# Altium project ECU_FEST24_Rev1.PrjPcb (part 2 of 2)

## Sheet PWR_CTRL.SchDoc: Power Control
size A4; Engineer: Rain Sarapuu; DocumentNumber: 6; Revision: 1; SheetNumber: 6; SheetTotal: 15
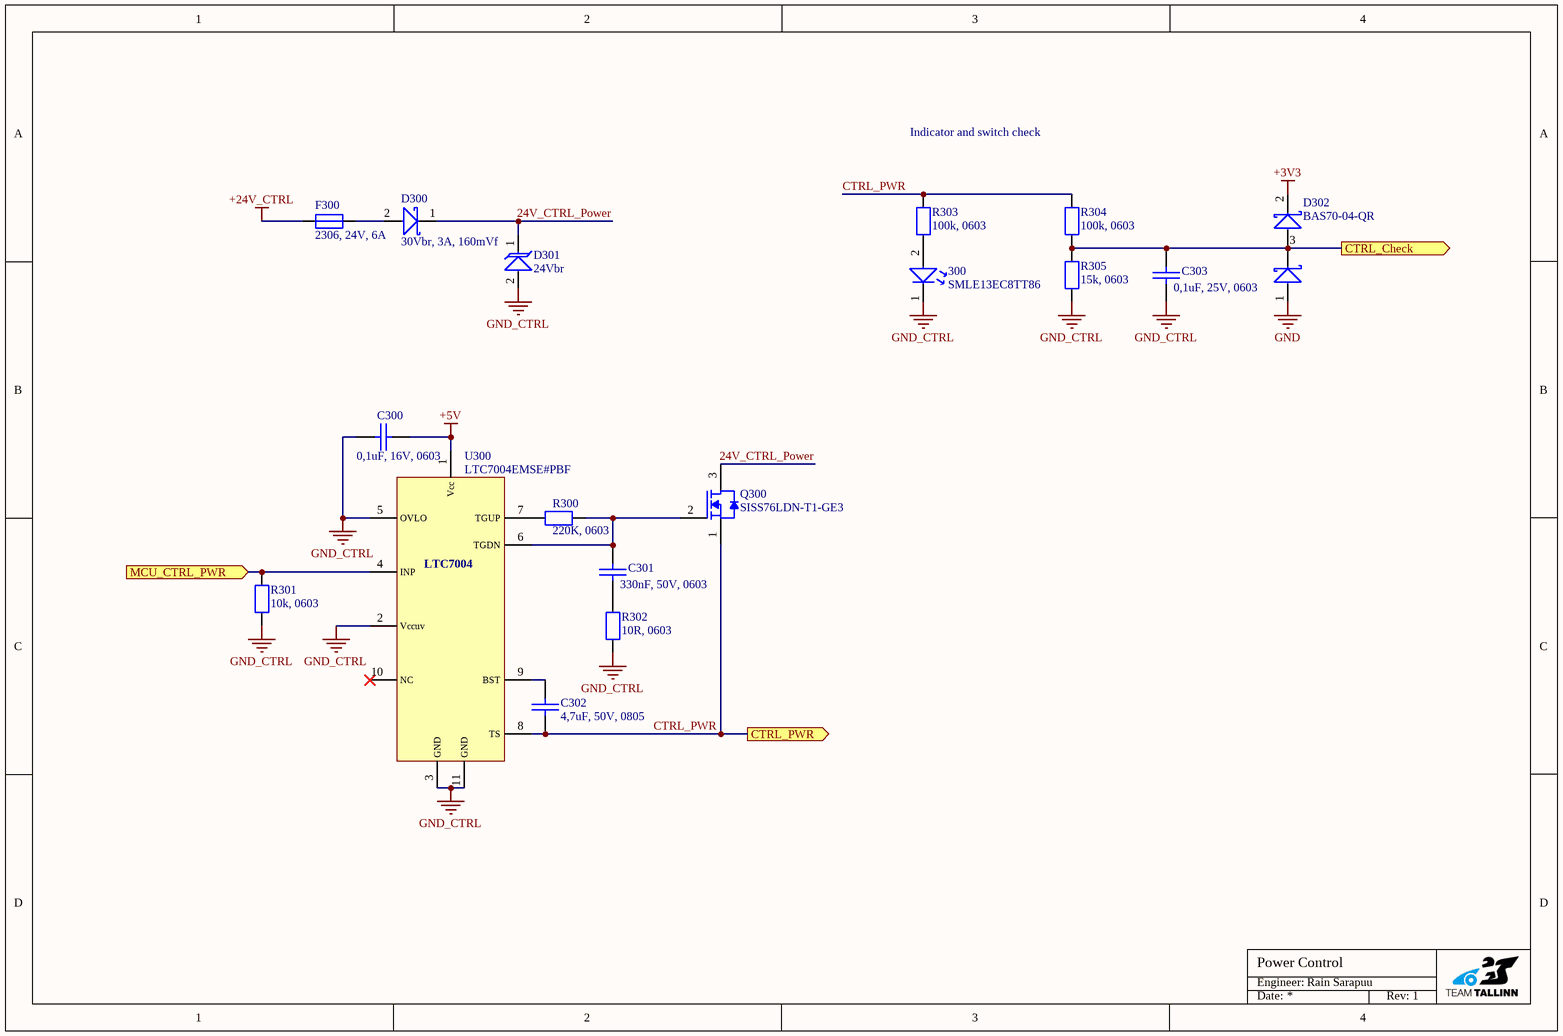
[diagram p14: PWR_CTRL.SchDoc]

### Parts
300  SMLE13EC8TT86  [LED [0603] 1608]
C300  0,1uF, 16V, 0603  [CAP [0603] 1608]
C301  330nF, 50V, 0603  [CAP [0603] 1608]
C302  4,7uF, 50V, 0805  [CAP [0805] 2012]
C303  0,1uF, 25V, 0603  [CAP [0603] 1608]
D300  30Vbr, 3A, 160mVf  [SOD-128]
D301  24Vbr  [SOD-128]
D302  BAS70-04-QR  [SOT23-3]
F300  2306, 24V, 6A  [FUSE [1206] 3216]
Q300  SISS76LDN-T1-GE3  [PowerPAK 1212-8S]
R300  220K, 0603  [RES [0603] 1608]
R301  10k, 0603  [RES [0603] 1608]
R302  10R, 0603  [RES [0603] 1608]
R303  100k, 0603  [RES [0603] 1608]
R304  100k, 0603  [RES [0603] 1608]
R305  15k, 0603  [RES [0603] 1608]
U300  LTC7004EMSE#PBF  [LTC7004EMSE#PBF-Footprint-1]

### Ports
CTRL_Check (out), CTRL_PWR (out), MCU_CTRL_PWR (in)

### Nets
+3V3: D302.2
+5V: C300.1 U300.1(Vcc)
+24V_CTRL: F300.2
GND: D302.1
GND_CTRL: 300.1 C300.2 C303.2 D301.2(A) R301.2 R302.1 R305.1 U300.2(Vccuv) U300.3(GND) U300.5(OVLO) U300.11(GND)
24V_CTRL_Power: D300.1(K) D301.1(K) Q300.3(D)
CTRL_PWR: C302.2 Q300.1(S) R303.2 R304.2 U300.8(TS) ; port CTRL_PWR
Net300_2: 300.2 R303.1
NetC301_1: C301.1 Q300.2(G) R300.2 U300.6(TGDN)
NetC301_2: C301.2 R302.2
NetC302_1: C302.1 U300.9(BST)
NetC303_1: C303.1 D302.3 R304.1 R305.2 ; port CTRL_Check
NetD300_2: D300.2(A) F300.1
NetR300_1: R300.1 U300.7(TGUP)
NetR301_1: R301.1 U300.4(INP) ; port MCU_CTRL_PWR

Not connected (* = marked no-connect by the designer): U300 10(NC)*

### Notes on the sheet
- Indicator and switch check
- Engineer:
- Date:
- Rev:
- (in symbol CMP-019-00014-3) LTC7004

### Library data of the parts
300 = CMP-004-00006-2: Single Color LED, Green, Colorless Transparent, 1.2mm; Manufacturer Part Number: SMLE13EC8TT86; Supplier Part Number: 755-SMLE13EC8TT86; Supplier: Mouser
C300-C303 = CMP-001-00084-16: Default capacitor part; Supplier Part Number: *; Supplier: *; Manufacturer Part Number: *
D300 = CMP-004-00020-1: Rectifier Diode, Schottky, 1 Phase, 1 Element, 3A, 30V V(RRM), Silicon; Manufacturer Part Number: PMEG3030EP,115; Supplier: Mouser; Supplier Part Number: 771-PMEG3030EP115
D301 = CMP-004-00018-1: Trans Voltage Suppressor Diode, 600W, 24V V(RWM), Unidirectional, 1 Element, Silicon; Manufacturer Part Number: VS24VUA1LAMTFTR; Supplier Part Number: 2989546; Supplier: Farnell
D302 = CMP-004-00033-4: Diode Small Signal Schottky 70V 70mA 3-Pin SOT-23 T/R; Manufacturer: Nexperia; Supplier Part Number: 771-BAS70-04-QR; Manufacturer Part Number: BAS70-04-QR; Supplier: Mouser; Price: 0,242
F300 = CMP-005-00006-1: Electric Fuse, 6A, 24VDC, 80A (IR), Surface Mount, 1206; Manufacturer Part Number: SF-1206HIA600M-2; Supplier: Farnell; Supplier Part Number: 3361312
Q300 = CMP-013-00023-1: Power Field-Effect Transistor; Manufacturer: Vishay; Price: 1,02; Supplier: Mouser; Manufacturer Part Number: SISS76LDN-T1-GE3; Supplier Part Number: 78-SISS76LDN-T1-GE3
R300-R305 = CMP-009-00038-12: Standard resistor part; Supplier Part Number: *; Manufacturer Part Number: *; Supplier: *
U300 = CMP-019-00014-3: Buffer/Inverter Based MOSFET Driver, CMOS, PDSO10; Manufacturer Part Number: LTC7004EMSE#PBF; Supplier: Mouser; Supplier Part Number: 584-LTC7004EMSEPBF

## Nets that join several sheets
+3V3: MCU (6 pins), MCU_external_components (8 pins), Power (C109.1 R107.2 U101.3), DigiAnalog_Inputs (6 pins), Motor_Temp_Measurement (C900.1 U900.1), Cooling_control (Q500.1 Q501.1 R501.2 R504.2), CAN_CTRL1 (C3041.1 C3051.1 U3011.6), CAN_CTRL2 (C3042.1 C3052.1 U3012.6), CAN (C200.1 C201.1 U201.6), PWR_CTRL (D302.2)
+3V3A: Overview (J100.1 J100.14), Temperature_inputs1 (D6001.2), Temperature_inputs2 (D6002.2), Temperature_inputs3 (D6003.2), Temperature_inputs4 (D6004.2), Temperature_inputs5 (D6005.2), Temperature_inputs6 (D6006.2), LinearSensor_inputs1 (D7001.2), LinearSensor_inputs2 (D7002.2), LinearSensor_inputs3 (D7003.2), LinearSensor_inputs4 (D7004.2), MCU (U200.21), MCU_external_components (C209.2 C210.2 R206.2), Power (C113.1 R108.2 U102.5)
+3V3A_iso: Motor_Temp_Measurement (C902.2 U901.1), Motor Temp Measurement/Wheatstone_bridge1 (R9021.1 R9031.1), Motor Temp Measurement/Wheatstone_bridge2 (R9022.1 R9032.1), Motor Temp Measurement/Wheatstone_bridge3 (R9023.1 R9033.1), Motor Temp Measurement/Wheatstone_bridge4 (R9024.1 R9034.1), Isolated_Power (C910.2 R901.2 U903.5)
+3V3D_iso: Motor_Temp_Measurement (7 pins), Isolated_Power (C908.2 R900.2 U902.5)
+5V: Power (6 pins), Cooling_control (10 pins), CAN_CTRL1 (C3061.1 C3071.1 U3011.8), CAN_CTRL2 (C3062.1 C3072.1 U3012.8), CAN (C202.1 C203.1 U201.8), PWR_CTRL (C300.1 U300.1)
+24V: Overview (J106.10), Power (D100.2 D102.2 R105.2)
+24V_CTRL: Overview (J105.4), PWR_CTRL (F300.2)
+24V_prot: Power (5 pins), Isolated_Power (C911.2 U904.2)
+24V_sw: Power (D102.1), Switched Power1 (F4001.2 R4001.2), Switched Power2 (F4002.2 R4002.2)
GND: Overview (6 pins), Temperature_inputs1 (C6001.2 D6001.1 R6011.2), Temperature_inputs2 (C6002.2 D6002.1 R6012.2), Temperature_inputs3 (C6003.2 D6003.1 R6013.2), Temperature_inputs4 (C6004.2 D6004.1 R6014.2), Temperature_inputs5 (C6005.2 D6005.1 R6015.2), Temperature_inputs6 (C6006.2 D6006.1 R6016.2), LinearSensor_inputs1 (C7001.2 D7001.1), LinearSensor_inputs2 (C7002.2 D7002.1), LinearSensor_inputs3 (C7003.2 D7003.1), LinearSensor_inputs4 (C7004.2 D7004.1), MCU (6 pins), MCU_external_components (23 pins), Power (19 pins), DigiAnalog_Inputs (12 pins), Motor_Temp_Measurement (C900.2 U900.8), Isolated_Power (C911.1 C914.1 U904.1), Switched Power1 (D4001.2 Q4001.5 R4041.1 R4051.1), Switched Power2 (D4002.2 Q4002.5 R4042.1 R4052.1), Cooling_control (7 pins), CAN_CTRL1 (9 pins), CAN_CTRL2 (9 pins), CAN (9 pins), PWR_CTRL (D302.1)
GND_CTRL: Overview (8 pins), Cooling_control (D500.2), PWR_CTRL (11 pins)
iso_GND: Overview (J101.1 J101.2 J101.3 J101.4), Motor_Temp_Measurement (11 pins), Motor Temp Measurement/Wheatstone_bridge1 (R9041.2), Motor Temp Measurement/Wheatstone_bridge2 (R9042.2), Motor Temp Measurement/Wheatstone_bridge3 (R9043.2), Motor Temp Measurement/Wheatstone_bridge4 (R9044.2), Isolated_Power (11 pins)
ADC_DRDY: MCU (U200.55), Motor_Temp_Measurement (U900.7)
ADC_RST: MCU (U200.56), Motor_Temp_Measurement (U900.2)
AIN_N: Motor_Temp_Measurement (U901.4), Motor Temp Measurement/Wheatstone_bridge1 (C9131.2 R9061.1)
AIN_N: Motor_Temp_Measurement (U901.5), Motor Temp Measurement/Wheatstone_bridge2 (C9132.2 R9062.1)
AIN_N: Motor_Temp_Measurement (U901.8), Motor Temp Measurement/Wheatstone_bridge3 (C9133.2 R9063.1)
AIN_N: Motor_Temp_Measurement (U901.9), Motor Temp Measurement/Wheatstone_bridge4 (C9134.2 R9064.1)
AIN_P: Motor_Temp_Measurement (U901.3), Motor Temp Measurement/Wheatstone_bridge1 (C9131.1 R9051.1)
AIN_P: Motor_Temp_Measurement (U901.6), Motor Temp Measurement/Wheatstone_bridge2 (C9132.1 R9052.1)
AIN_P: Motor_Temp_Measurement (U901.7), Motor Temp Measurement/Wheatstone_bridge3 (C9133.1 R9053.1)
AIN_P: Motor_Temp_Measurement (U901.10), Motor Temp Measurement/Wheatstone_bridge4 (C9134.1 R9054.1)
Boot: MCU (U200.94), MCU_external_components (R207.2)
CAN_GND: Overview (J106.8), CAN (8 pins)
CAN_H: Overview (J106.7), CAN (S200.1 U201.17)
CAN_L: Overview (J106.6), CAN (S200.2 U201.15)
CAN_RX: MCU (U200.67), CAN (U201.4)
CAN_TX: MCU (U200.77), CAN (U201.5)
CTRL_CAN_GND: Overview (J103.6), CAN_CTRL1 (11 pins)
CTRL_CAN_GND: Overview (J104.6), CAN_CTRL2 (11 pins)
CTRL_CAN_H: Overview (J103.4), CAN_CTRL1 (C3121.1 D3031.2 L3001.4 R3101.2)
CTRL_CAN_H: Overview (J104.4), CAN_CTRL2 (C3122.1 D3032.2 L3002.4 R3102.2)
CTRL_CAN_L: Overview (J103.5), CAN_CTRL1 (C3131.2 D3031.1 L3001.3 R3111.2)
CTRL_CAN_L: Overview (J104.5), CAN_CTRL2 (C3132.2 D3032.1 L3002.3 R3112.2)
CTRL_CAN_RX: MCU (U200.51), CAN_CTRL2 (U3012.4)
CTRL_CAN_RX: MCU (U200.70), CAN_CTRL1 (U3011.4)
CTRL_CAN_TX: MCU (U200.52), CAN_CTRL2 (U3012.5)
CTRL_CAN_TX: MCU (U200.71), CAN_CTRL1 (U3011.5)
CTRL_PWR: Overview (J103.2 J104.2), PWR_CTRL (5 pins)
Debug_LED1: MCU (U200.81), MCU_external_components (R204.2)
Debug_LED2: MCU (U200.82), MCU_external_components (R205.2)
DigiAnalog_in1: Overview (J100.16), DigiAnalog_Inputs (R800.1 R802.2)
DigiAnalog_in2: Overview (J100.15), DigiAnalog_Inputs (R805.1 R807.2)
Error_LED: MCU (U200.83), MCU_external_components (R203.2)
LinearSens1: Overview (J100.13), LinearSensor_inputs1 (R7001.2)
LinearSens2: Overview (J100.12), LinearSensor_inputs2 (R7002.2)
LinearSens3: Overview (J100.11), LinearSensor_inputs3 (R7003.2)
LinearSens4: Overview (J100.10), LinearSensor_inputs4 (R7004.2)
LowPWR_Check1: MCU (U200.97), Switched Power1 (R4021.1 R4051.2)
LowPWR_Check2: MCU (U200.1), Switched Power2 (R4022.1 R4052.2)
LowPWR_OUT: Overview (J106.5), Switched Power1 (D4001.1 Q4001.4 R4021.2)
LowPWR_OUT: Overview (J106.4), Switched Power2 (D4002.1 Q4002.4 R4022.2)
LowPWR_Switch1: MCU (U200.98), Switched Power1 (R4031.2)
LowPWR_Switch2: MCU (U200.2), Switched Power2 (R4032.2)
MCU_DigiAnalog1: MCU (U200.28), DigiAnalog_Inputs (C801.1 D801.3 R802.1 R804.2)
MCU_DigiAnalog2: MCU (U200.29), DigiAnalog_Inputs (C803.1 D803.3 R807.1 R809.2)
MCU_LinearSens1: LinearSensor_inputs1 (C7001.1 D7001.3 R7001.1), MCU (U200.30)
MCU_LinearSens2: LinearSensor_inputs2 (C7002.1 D7002.3 R7002.1), MCU (U200.31)
MCU_LinearSens3: LinearSensor_inputs3 (C7003.1 D7003.3 R7003.1), MCU (U200.32)
MCU_LinearSens4: LinearSensor_inputs4 (C7004.1 D7004.3 R7004.1), MCU (U200.33)
MCU_Pump_Tach: MCU (U200.92), DigiAnalog_Inputs (C802.1 D802.3 R806.2 R808.2)
MCU_SHTD_in: MCU (U200.37), DigiAnalog_Inputs (C800.1 D800.3 R801.2 R803.2)
MCU_SPI_CLK: MCU (U200.46), Motor_Temp_Measurement (U900.4)
MCU_SPI_CS: MCU (U200.90), Motor_Temp_Measurement (U900.3)
MCU_SPI_MISO: MCU (U200.53), Motor_Temp_Measurement (U900.6)
MCU_SPI_MOSI: MCU (U200.54), Motor_Temp_Measurement (U900.5)
MCU_Temp1: Temperature_inputs1 (C6001.1 D6001.3 R6001.1), MCU (U200.17)
MCU_Temp2: Temperature_inputs2 (C6002.1 D6002.3 R6002.1), MCU (U200.18)
MCU_Temp3: Temperature_inputs3 (C6003.1 D6003.3 R6003.1), MCU (U200.22)
MCU_Temp4: Temperature_inputs4 (C6004.1 D6004.3 R6004.1), MCU (U200.23)
MCU_Temp5: Temperature_inputs5 (C6005.1 D6005.3 R6005.1), MCU (U200.24)
MCU_Temp6: Temperature_inputs6 (C6006.1 D6006.3 R6006.1), MCU (U200.25)
Motor_Temp+1: Overview (J101.8), Motor Temp Measurement/Wheatstone_bridge1 (R9031.2 R9051.2)
Motor_Temp+2: Overview (J101.7), Motor Temp Measurement/Wheatstone_bridge2 (R9032.2 R9052.2)
Motor_Temp+3: Overview (J101.6), Motor Temp Measurement/Wheatstone_bridge3 (R9033.2 R9053.2)
Motor_Temp+4: Overview (J101.5), Motor Temp Measurement/Wheatstone_bridge4 (R9034.2 R9054.2)
NetC303_1: MCU (U200.80), PWR_CTRL (C303.1 D302.3 R304.1 R305.2)
NetQ500_2: MCU (U200.91), Cooling_control (Q500.2 R501.1)
NetQ501_2: MCU (U200.39), Cooling_control (Q501.2 R504.1)
NetR301_1: MCU (U200.79), PWR_CTRL (R301.1 U300.4)
NRST: MCU (U200.14), MCU_external_components (C220.1 D200.4 J200.2)
OSC_IN: MCU (U200.12), MCU_external_components (C221.1 X200.3)
OSC_OUT: MCU (U200.13), MCU_external_components (C222.1 X200.1)
Pump_Tach: Overview (J105.1), DigiAnalog_Inputs (R806.1)
PWM_Fan: Overview (J106.1), Cooling_control (D501.1 Q501.3 R503.1)
PWM_Pump: Overview (J105.3), Cooling_control (D500.1 R500.2 U500.2)
SHTD_in: Overview (J106.2), DigiAnalog_Inputs (R801.1)
SWCLK: MCU (U200.76), MCU_external_components (D200.1 J200.5)
SWDIO: MCU (U200.72), MCU_external_components (D200.3 J200.3)
SWO: MCU (U200.89), MCU_external_components (D200.6 J200.6)
Temp1: Overview (J100.7), Temperature_inputs1 (R6001.2 R6011.1)
Temp2: Overview (J100.6), Temperature_inputs2 (R6002.2 R6012.1)
Temp3: Overview (J100.5), Temperature_inputs3 (R6003.2 R6013.1)
Temp4: Overview (J100.4), Temperature_inputs4 (R6004.2 R6014.1)
Temp5: Overview (J100.3), Temperature_inputs5 (R6005.2 R6015.1)
Temp6: Overview (J100.2), Temperature_inputs6 (R6006.2 R6016.1)
VCAP1: MCU (U200.48), MCU_external_components (C218.1)
VCAP2: MCU (U200.73), MCU_external_components (C219.1)
VREF+: MCU (U200.20), MCU_external_components (R206.1)